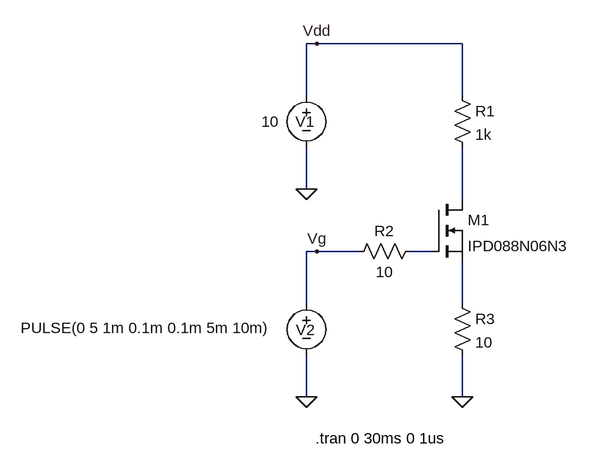
[diagram p0: schematic PySpice_How_To_Simulate_A_Mosfet.asc]
PySpice_How_To_Simulate_A_Mosfet.asc, the LTspice schematic file:
Version 4
SHEET 1 880 680
WIRE -32 -48 -48 -48
WIRE 192 -48 -32 -48
WIRE -48 32 -48 -48
WIRE 192 32 192 -48
WIRE -48 176 -48 112
WIRE 192 192 192 112
WIRE -32 272 -48 272
WIRE 32 272 -32 272
WIRE 144 272 112 272
WIRE -48 352 -48 272
WIRE 192 352 192 288
WIRE -48 496 -48 432
WIRE 192 496 192 432
FLAG 192 496 0
FLAG -48 496 0
FLAG -48 176 0
FLAG -32 -48 Vdd
FLAG -32 272 Vg
SYMBOL nmos 144 192 R0
SYMATTR InstName M1
SYMATTR Value IPD088N06N3
SYMBOL res 176 16 R0
SYMATTR InstName R1
SYMATTR Value 1k
SYMBOL res 128 256 R90
WINDOW 0 0 56 VBottom 2
WINDOW 3 32 56 VTop 2
SYMATTR InstName R2
SYMATTR Value 10
SYMBOL voltage -48 336 R0
WINDOW 0 -16 57 Left 2
WINDOW 3 -440 54 Left 2
WINDOW 123 0 0 Left 0
WINDOW 39 0 0 Left 0
SYMATTR InstName V2
SYMATTR Value PULSE(0 5 1m 0.1m 0.1m 5m 10m)
SYMBOL voltage -48 16 R0
WINDOW 0 -17 56 Left 2
WINDOW 3 -69 56 Left 2
WINDOW 123 0 0 Left 0
WINDOW 39 0 0 Left 0
SYMATTR InstName V1
SYMATTR Value 10
SYMBOL res 176 336 R0
SYMATTR InstName R3
SYMATTR Value 10
TEXT -34 560 Left 2 !.tran 0 30ms 0 1us

The netlist it stands for:
* PySpice_How_To_Simulate_A_Mosfet.asc
M1 N001 N002 N003 N003 IPD088N06N3
R1 Vdd N001 1k
R2 N002 Vg 10
V2 Vg 0 PULSE(0 5 1m 0.1m 0.1m 5m 10m)
V1 Vdd 0 10
R3 N003 0 10
.model NMOS NMOS
.model PMOS PMOS
.lib standard.mos
.tran 0 30ms 0 1us
.backanno
.end